# Altium schematic sheet 驱动.SchDoc
size A3
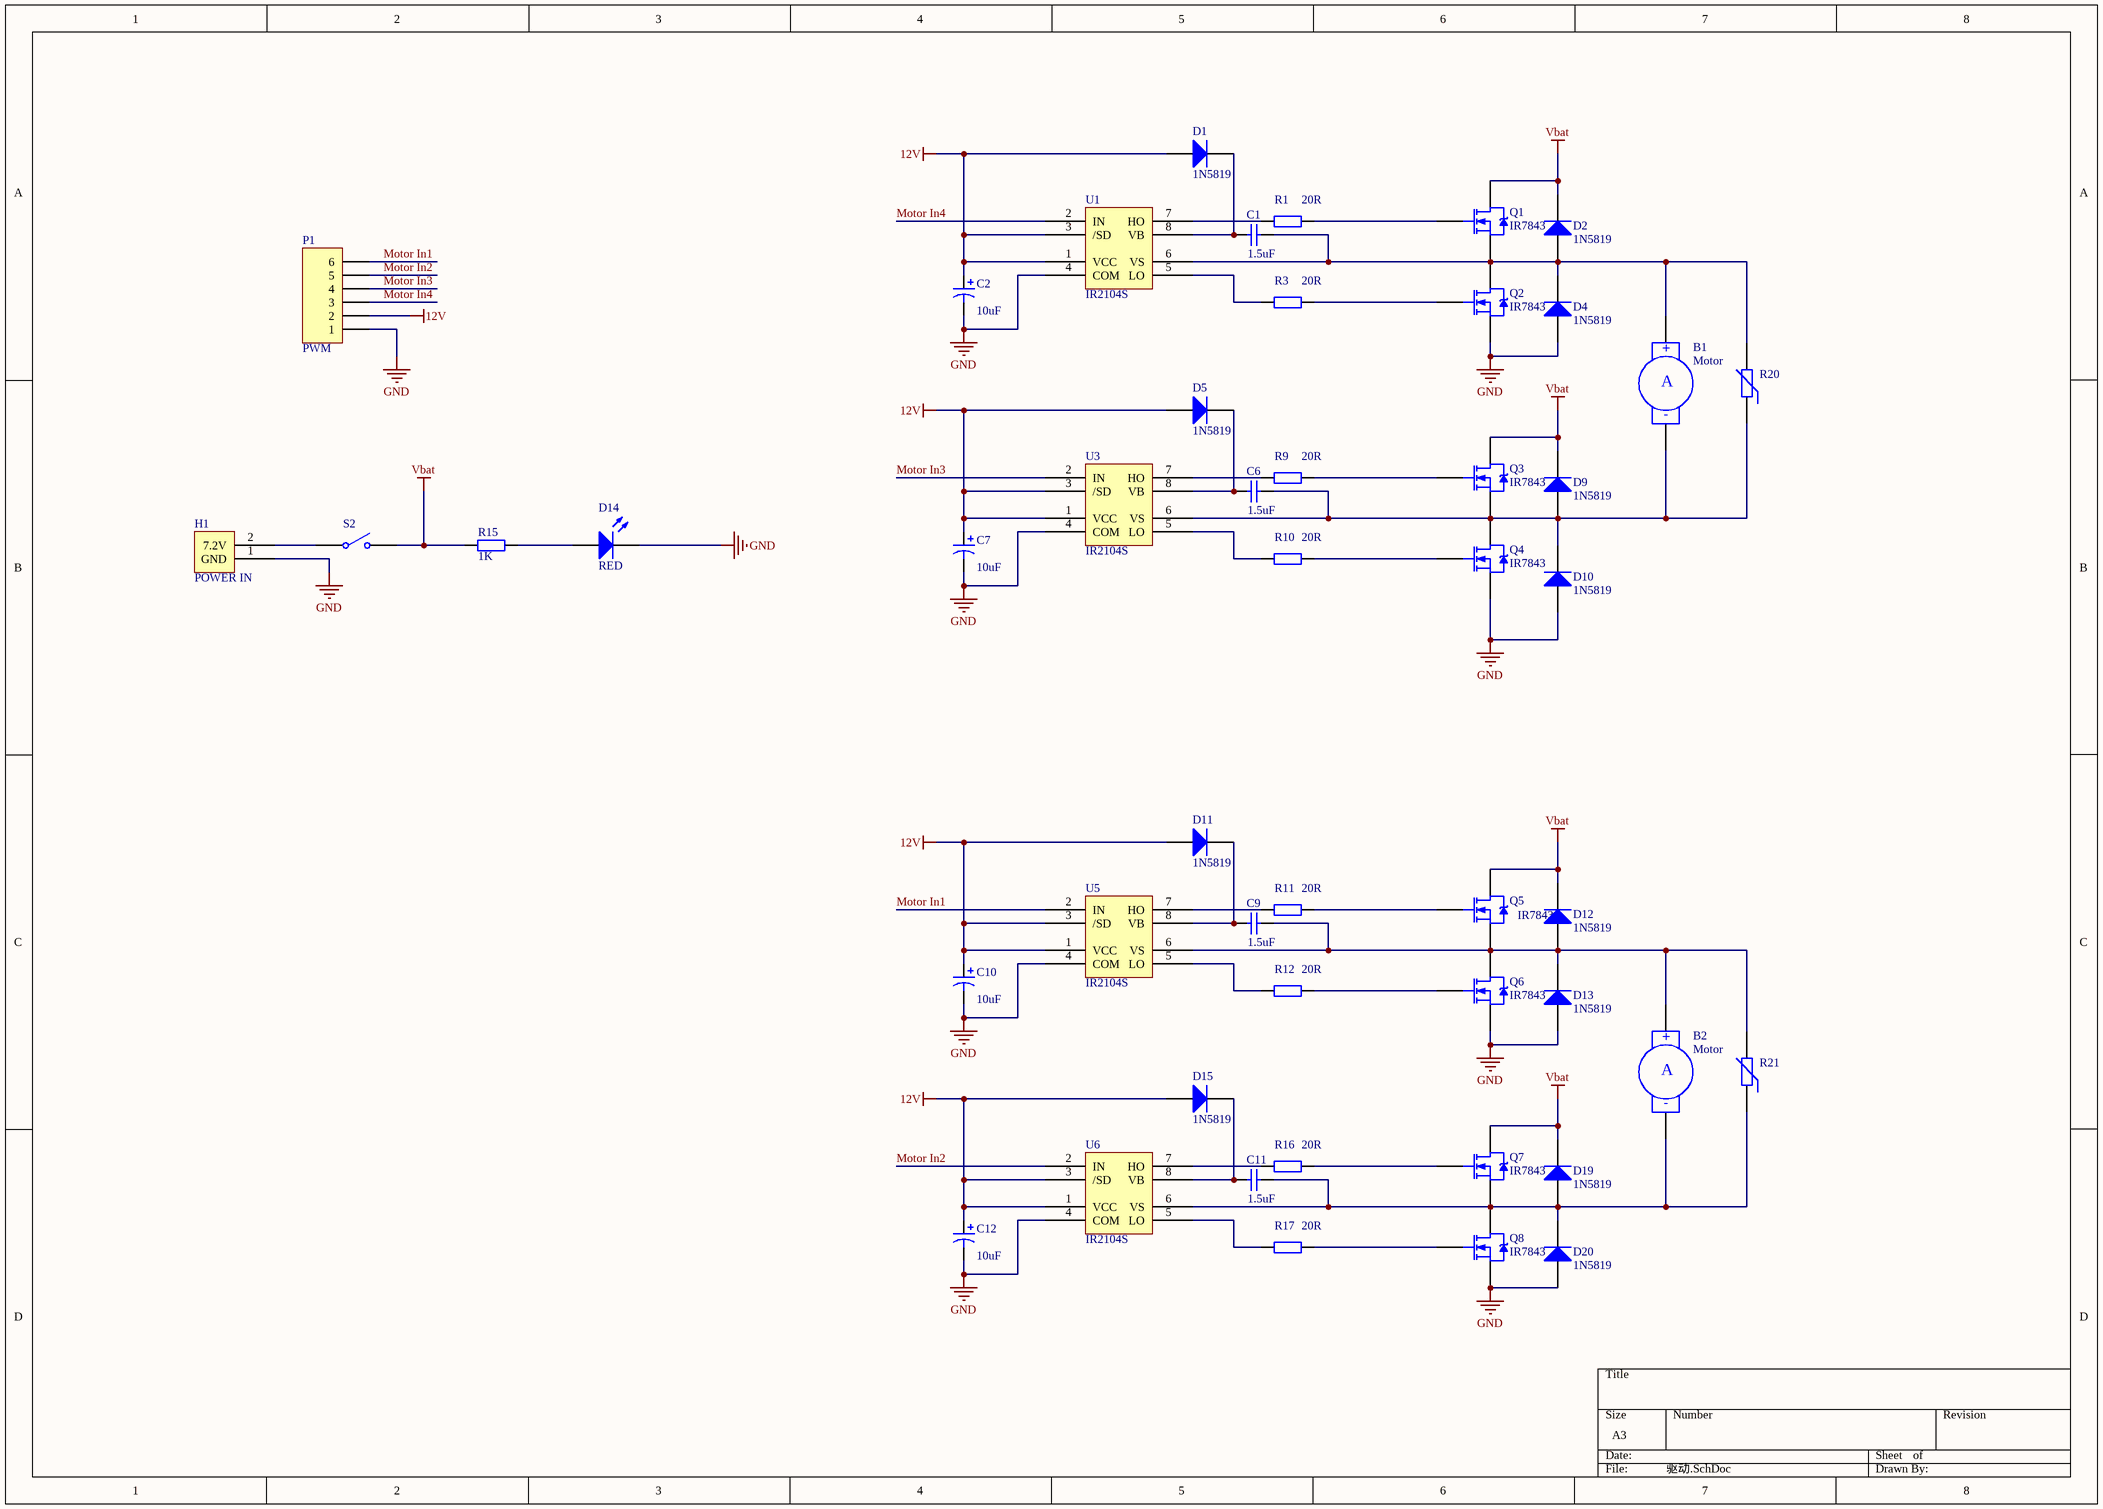
[diagram p0: 驱动.SchDoc]

## Parts
B1  Motor  [KF301-2P]
B2  Motor  [KF301-2P]
C1  value 1.5uF  [0805(2012)]  (hidden comment: Cap)
C2  value 10uF  [SOD-323(0805)]  (hidden comment: Cap Pol1)
C6  value 1.5uF  [0805(2012)]  (hidden comment: Cap)
C7  value 10uF  [SOD-323(0805)]  (hidden comment: Cap Pol1)
C9  value 1.5uF  [0805(2012)]  (hidden comment: Cap)
C10  value 10uF  [SOD-323(0805)]  (hidden comment: Cap Pol1)
C11  value 1.5uF  [0805(2012)]  (hidden comment: Cap)
C12  value 10uF  [SOD-323(0805)]  (hidden comment: Cap Pol1)
D1  1N5819  [0805(2012)]
D2  1N5819  [0805(2012)]
D4  1N5819  [0805(2012)]
D5  1N5819  [0805(2012)]
D9  1N5819  [0805(2012)]
D10  1N5819  [0805(2012)]
D11  1N5819  [0805(2012)]
D12  1N5819  [0805(2012)]
D13  1N5819  [0805(2012)]
D14  RED  [0805LED]
D15  1N5819  [0805(2012)]
D19  1N5819  [0805(2012)]
D20  1N5819  [0805(2012)]
H1  POWER IN  [KF301-2P]
P1  PWM  [HDR1X6]
Q1  IR7843  [LR7843]
Q2  IR7843  [LR7843]
Q3  IR7843  [LR7843]
Q4  IR7843  [LR7843]
Q5  IR7843  [LR7843]
Q6  IR7843  [LR7843]
Q7  IR7843  [LR7843]
Q8  IR7843  [LR7843]
R1  value 20R  [0805(2012)]  (hidden comment: Res2)
R3  value 20R  [0805(2012)]  (hidden comment: Res2)
R9  value 20R  [0805(2012)]  (hidden comment: Res2)
R10  value 20R  [0805(2012)]  (hidden comment: Res2)
R11  value 20R  [0805(2012)]  (hidden comment: Res2)
R12  value 20R  [0805(2012)]  (hidden comment: Res2)
R15  value 1K  [0805(2012)]  (hidden comment: Res2)
R16  value 20R  [0805(2012)]  (hidden comment: Res2)
R17  value 20R  [0805(2012)]  (hidden comment: Res2)
R20  Res Varistor  [0805]  (value not drawn)
R21  Res Varistor  [0805]  (value not drawn)
S2  zk  [SWITCH]  (value not drawn)
U1  IR2104S  [IR2104S]
U3  IR2104S  [IR2104S]
U5  IR2104S  [IR2104S]
U6  IR2104S  [IR2104S]

## Nets
12V: C2.1 C7.1 C10.1 C12.1 D1.2(A) D5.2(A) D11.2(A) D15.2(A) P1.2 U1.1(VCC) U1.3(/SD) U3.1(VCC) U3.3(/SD) U5.1(VCC) U5.3(/SD) U6.1(VCC) U6.3(/SD)
GND: C2.2 C7.2 C10.2 C12.2 D4.2(A) D10.2(A) D13.2(A) D14.2(K) D20.2(A) H1.1(GND) P1.1 Q2.3(S) Q4.3(S) Q6.3(S) Q8.3(S) U1.4(COM) U3.4(COM) U5.4(COM) U6.4(COM)
Vbat: D2.1(K) D9.1(K) D12.1(K) D19.1(K) Q1.2(D) Q3.2(D) Q5.2(D) Q7.2(D) R15.1 S2.2(NO)
Motor In1: P1.6 U5.2(IN)
Motor In2: P1.5 U6.2(IN)
Motor In3: P1.4 U3.2(IN)
Motor In4: P1.3 U1.2(IN)
NetB1_1: B1.1(+) C1.2 D2.2(A) D4.1(K) Q1.3(S) Q2.2(D) R20.2 U1.6(VS)
NetB1_2: B1.2(-) C6.2 D9.2(A) D10.1(K) Q3.3(S) Q4.2(D) R20.1 U3.6(VS)
NetB2_1: B2.1(+) C9.2 D12.2(A) D13.1(K) Q5.3(S) Q6.2(D) R21.2 U5.6(VS)
NetB2_2: B2.2(-) C11.2 D19.2(A) D20.1(K) Q7.3(S) Q8.2(D) R21.1 U6.6(VS)
NetC1_1: C1.1 D1.1(K) U1.8(VB)
NetC6_1: C6.1 D5.1(K) U3.8(VB)
NetC9_1: C9.1 D11.1(K) U5.8(VB)
NetC11_1: C11.1 D15.1(K) U6.8(VB)
NetD14_1: D14.1(A) R15.2
NetH1_2: H1.2(7.2V) S2.1(COMMON)
NetQ1_1: Q1.1(G) R1.2
NetQ2_1: Q2.1(G) R3.2
NetQ3_1: Q3.1(G) R9.2
NetQ4_1: Q4.1(G) R10.2
NetQ5_1: Q5.1(G) R11.2
NetQ6_1: Q6.1(G) R12.2
NetQ7_1: Q7.1(G) R16.2
NetQ8_1: Q8.1(G) R17.2
NetR1_1: R1.1 U1.7(HO)
NetR3_1: R3.1 U1.5(LO)
NetR9_1: R9.1 U3.7(HO)
NetR10_1: R10.1 U3.5(LO)
NetR11_1: R11.1 U5.7(HO)
NetR12_1: R12.1 U5.5(LO)
NetR16_1: R16.1 U6.7(HO)
NetR17_1: R17.1 U6.5(LO)

## Notes on the sheet
- (in symbol Motor Servo) A

## Library data of the parts
B1 B2 = Motor Servo: Servo Motor; Published: 24-Mar-1999; LatestRevisionDate: 17-Jul-2002; LatestRevisionNote: Re-released for DXP Platform.; PackageReference: RAD-0.4; Publisher: Altium Limited; PackageDescription: Radial Cap, Thru-Hole; 2 Leads; 0.4 in Pin Spacing
C1 C6 C9 C11 = Cap: Capacitor; Published: 8-Jun-2000; LatestRevisionDate: 17-Jul-2002; LatestRevisionNote: Re-released for DXP Platform.; PackageReference: RAD-0.3; Publisher: Altium Limited; PackageDescription: Radial Cap, Thru-Hole; 2 Leads; 0.3 in Pin Spacing
C2 C7 C10 C12 = Cap Pol1: Polarized Capacitor (Radial); Published: 8-Jun-2000; LatestRevisionDate: 17-Jul-2002; LatestRevisionNote: Re-released for DXP Platform.; PackageReference: RB7.6-15; Publisher: Altium Limited; PackageDescription: Polarized Capacitor (Radial); 2 Leads
D1 D2 D4 D5 D9-D13 D15 D19 D20 = 1N4148: Silicon Epitaxial Planar Diode for Various Detector, Modulator, Demodulator; Published: 12-Feb-2010; DatasheetVersion: Rev.5.00, Jul-2006; PackageVersion: Aug-2005; PackageReference: GRZZ0002ZB-A; Publisher: Altium Limited; PackageDescription: Diode, Axial; Body 4.2 x 2.0 mm (LxDia.), Lead Dia. 0.5 mm (nom); Code_JEITA: SC-40; ComponentLink1Description: Manufacturer Link; ComponentLink1URL: http://sg.renesas.com/fmwk.jsp?cnt=diode_landing.jsp&fp=/products/discrete/diodes/; ComponentLink2Description: Datasheet; ComponentLink2URL: http://documentation.renesas.com/eng/products/diode/rej03g0556_1n4148.pdf; ComponentLink3Description: Packaging Specification; ComponentLink3URL: http://sg.renesas.com/media/products/common_info/package/pdf/diode/code/grzz0002zb_a.pdf
D14 = LED2: Typical RED, GREEN, YELLOW, AMBER GaAs LED; Published: 8-Jun-2000; LatestRevisionDate: 17-Jul-2002; LatestRevisionNote: Re-released for DXP Platform.; PackageVersion: Feb-2002; PackageReference: 3.2X1.6X1.1; Publisher: Altium Limited; PackageDescription: SM LED; 2 Flat Leads
P1 = Header 6: Header, 6-Pin; LatestRevisionDate: 17-Jul-2002; LatestRevisionNote: Re-released for DXP Platform.; Publisher: Altium Limited
Q1-Q8 = IR7843: N-Channel Power MOSFET; Note: Pin 2 is electrically connected to pin 4.; Published: 8-Jun-2000; LatestRevisionDate: 17-Jul-2002; LatestRevisionNote: Re-released for DXP Platform.; DatasheetVersion: PD-9.814; PackageVersion: Feb-1997; PackageReference: TO-220AB; Publisher: Altium Limited; PackageDescription: TO, Thru-Hole, Vertical, Heatsink Mounted; 3 In-Line Leads; Pitch 2.54 mm; ComponentLink1Description: Manufacturer Link; ComponentLink1URL: http://www.irf.com/
R1 R3 R9-R12 R15-R17 = Res2: Resistor; Published: 8-Jun-2000; LatestRevisionDate: 17-Jul-2002; LatestRevisionNote: Re-released for DXP Platform.; PackageReference: AXIAL-0.4; Publisher: Altium Limited; PackageDescription: Axial Device, Thru-Hole; 2 Leads; 0.4 in Pin Spacing
R20 R21 = Res Varistor: Varistor (Voltage-Sensitive Resistor); Published: 24-Mar-1999; LatestRevisionDate: 29-May-2009; LatestRevisionNote: IPC-7351 Footprint Added.; PackageVersion: Mar-2003; PackageReference: 6-0805; Publisher: Altium Limited; PackageDescription: Chip Resistor 0805 Case Size; Code_IPC: RESC2012
S2 = SW-SPST: Single-Pole, Single-Throw Switch; Published: 24-Mar-1999; LatestRevisionDate: 17-Jul-2002; LatestRevisionNote: Re-released for DXP Platform.; PackageReference: SPST-2; Publisher: Altium Limited; PackageDescription: Switch; 2 Leads